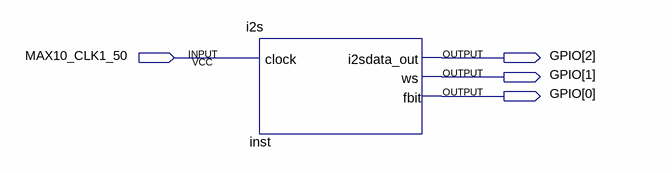
[diagram p0: schematic sheet]
// Quartus schematic i2s_top.bdf as structural Verilog: 1 symbols, 4 pins
module i2s_top (
  input  MAX10_CLK1_50,
  output [2:0] GPIO
);

  i2s inst (.clock(MAX10_CLK1_50), .i2sdata_out(GPIO[2]), .ws(GPIO[1]), .fbit(GPIO[0]));
endmodule
